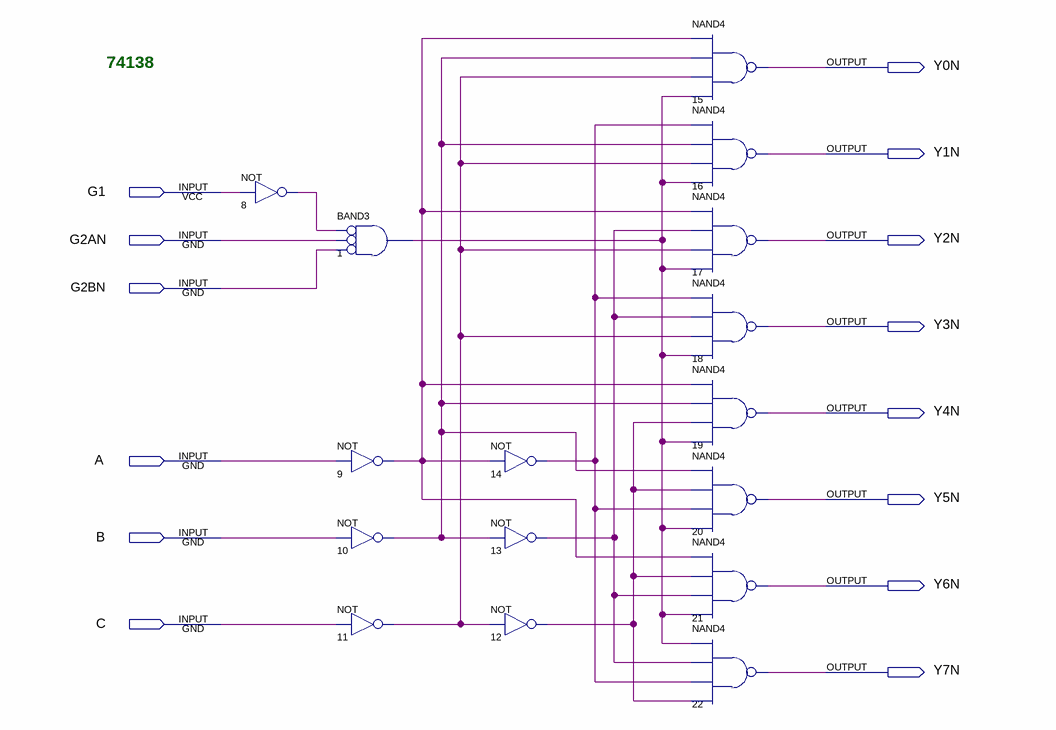
[diagram p0: schematic sheet]
// Quartus schematic 74138.bdf as structural Verilog: 16 symbols, 14 pins
module \74138  (
  input  G1,
  input  G2AN,
  input  G2BN,
  input  A,
  input  B,
  input  C,
  output Y0N,
  output Y1N,
  output Y2N,
  output Y3N,
  output Y4N,
  output Y5N,
  output Y6N,
  output Y7N
);

  wire n1_out, n8_out, n9_out, n10_out, n11_out, n12_out, n13_out, n14_out;

  not u_8 (n8_out, G1);
  and u_1 (n1_out, ~n8_out, ~G2AN, ~G2BN);  // BAND3
  not u_9 (n9_out, A);
  not u_10 (n10_out, B);
  not u_11 (n11_out, C);
  not u_14 (n14_out, n9_out);
  not u_13 (n13_out, n10_out);
  not u_12 (n12_out, n11_out);
  nand u_15 (Y0N, n9_out, n10_out, n11_out, n1_out);
  nand u_16 (Y1N, n14_out, n10_out, n11_out, n1_out);
  nand u_17 (Y2N, n9_out, n13_out, n11_out, n1_out);
  nand u_18 (Y3N, n14_out, n13_out, n11_out, n1_out);
  nand u_19 (Y4N, n9_out, n10_out, n12_out, n1_out);
  nand u_20 (Y5N, n10_out, n12_out, n14_out, n1_out);
  nand u_21 (Y6N, n9_out, n12_out, n13_out, n1_out);
  nand u_22 (Y7N, n1_out, n13_out, n14_out, n12_out);

  // Notes on the sheet:
  //   74138
endmodule
